# EAGLE design OBC.v1.rev.d (EAGLE 7.1.0)
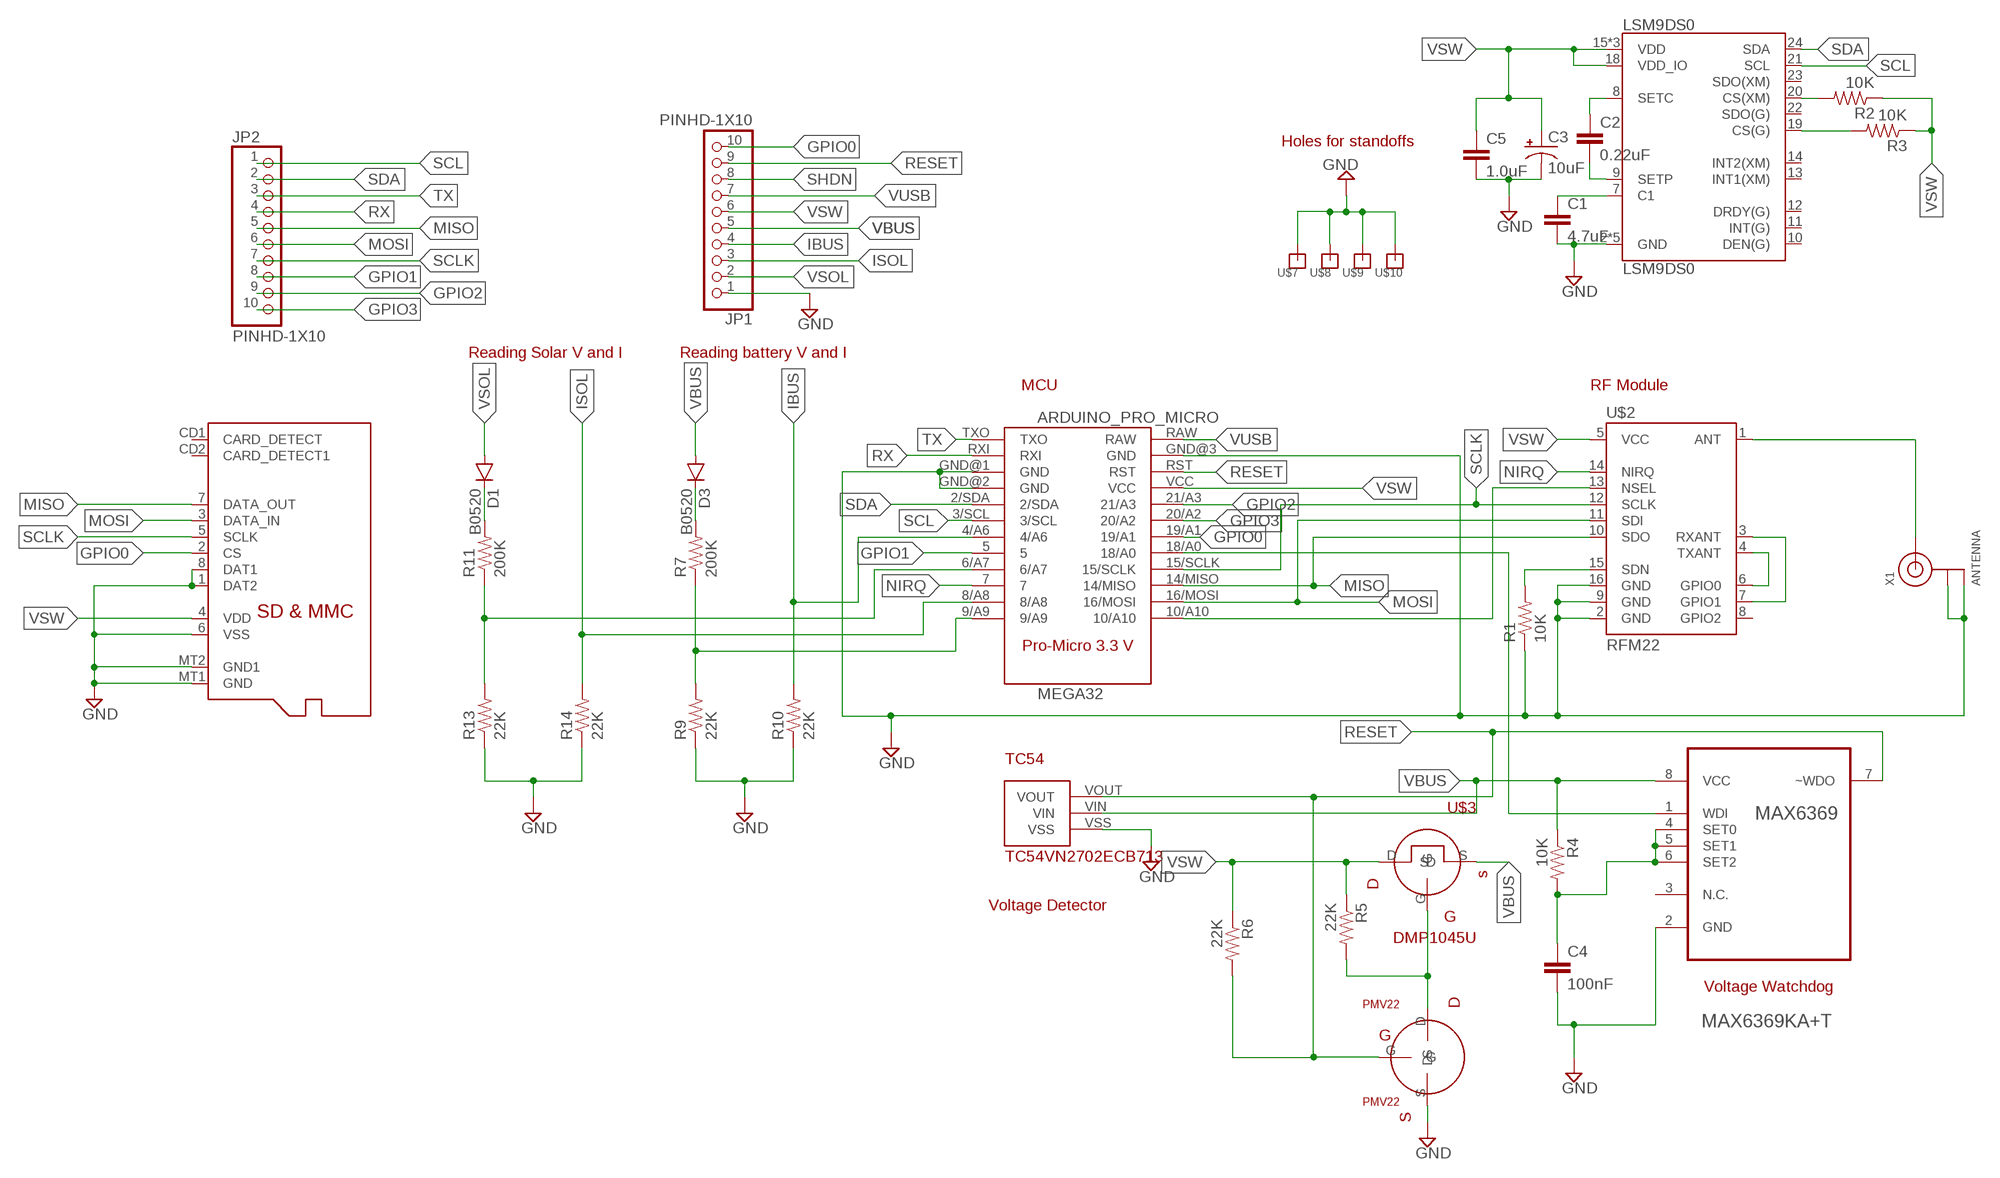
[diagram p0: schematic, sheet 1]

## Parts
ARDUINO_PRO_MICRO  MEGA32  [MEGA32]
C1  4.7uF  CAP0402-CAP  [0402-CAP]
C2  0.22uF  CAP0402-CAP  [0402-CAP]
C3  10uF  CAP_POL1206  [EIA3216]
C4  100nF  CAP0402-CAP  [0402-CAP]
C5  1.0uF  CAP0402-CAP  [0402-CAP]
D1  B0520  DIODESOD123  [SOD-123]
D3  B0520  DIODESOD123  [SOD-123]
JP1  PINHD-1X10  [1X10-BIG]
JP2  PINHD-1X10  [1X10-BIG]
LSM9DS0  LSM9DS0  [LGA-24]
MAX6369  MAX6369KA+T  [SOT65P280X145-8N]
PMV22  PMV22  [PMV22]
R1  10K  RESISTOR0402-RES  [0402-RES]
R2  10K  RESISTOR0402-RES  [0402-RES]
R3  10K  RESISTOR0402-RES  [0402-RES]
R4  10K  RESISTOR0402-RES  [0402-RES]
R5  22K  RESISTOR0402-RES  [0402-RES]
R6  22K  RESISTOR0402-RES  [0402-RES]
R7  200K  RESISTOR0402-RES  [0402-RES]
R9  22K  RESISTOR0402-RES  [0402-RES]
R10  22K  RESISTOR0402-RES  [0402-RES]
R11  200K  RESISTOR0402-RES  [0402-RES]
R13  22K  RESISTOR0402-RES  [0402-RES]
R14  22K  RESISTOR0402-RES  [0402-RES]
TC54  TC54VN2702ECB713  TC54  [TC54]
U$2  RFM22  RFM22SMD  [RFM22-XXX-S2]
U$3  DMP1045U  [DMP1045U]
U$7  3MMPILAR  [3MMPILAR]
U$8  3MMPILAR  [3MMPILAR]
U$9  3MMPILAR  [3MMPILAR]
U$10  3MMPILAR  [3MMPILAR]
X1  ANTENNA  ANTENNA_U.FL  [U.FL]
μSD  MICROSD  [MICROSD]

## Nets
DUMMY: ARDUINO_PRO_MICRO.9/A9 R7.1 R9.2
GND: ARDUINO_PRO_MICRO.GND@1(GND) ARDUINO_PRO_MICRO.GND@2(GND) ARDUINO_PRO_MICRO.GND@3(GND) C1.2 C3.C(-) C4.2 C5.2 JP1.1 LSM9DS0.2(GND) LSM9DS0.3(GND) LSM9DS0.4(GND) LSM9DS0.5(GND) LSM9DS0.6(GND) MAX6369.2(GND) PMV22.S R1.1 R9.1 R10.1 R13.1 R14.1 TC54.VSS U$2.2(GND) U$2.9(GND) U$2.16(GND) U$7.P$1 U$8.P$1 U$9.P$1 U$10.P$1 X1.1(GND) X1.2(GND) μSD.1(DAT2) μSD.6(VSS) μSD.8(DAT1) μSD.MT1(GND) μSD.MT2(GND1)
GPIO0: ARDUINO_PRO_MICRO.19/A1 JP1.10 μSD.2(CS)
GPIO1: ARDUINO_PRO_MICRO.5 JP2.8
GPIO2: ARDUINO_PRO_MICRO.21/A3 JP2.9
GPIO3: ARDUINO_PRO_MICRO.20/A2 JP2.10
IBUS: ARDUINO_PRO_MICRO.4/A6 JP1.4 R10.2
ISOL: ARDUINO_PRO_MICRO.8/A8 JP1.3 R14.2
MISO: ARDUINO_PRO_MICRO.14/MISO JP2.5 U$2.10(SDO) μSD.7(DATA_OUT)
MOSI: ARDUINO_PRO_MICRO.16/MOSI JP2.6 U$2.11(SDI) μSD.3(DATA_IN)
N$1: U$2.1(ANT) X1.3(SIGNAL)
N$2: U$2.3(RXANT) U$2.7(GPIO1)
N$3: R1.2 U$2.15(SDN)
N$4: C1.1 LSM9DS0.7(C1)
N$5: U$2.4(TXANT) U$2.6(GPIO0)
N$6: C2.2 LSM9DS0.9(SETP)
N$7: C2.1 LSM9DS0.8(SETC)
N$9: LSM9DS0.20(CS(XM)) R2.2
N$10: LSM9DS0.19(CS(G)) R3.2
N$12: D3.C R7.2
N$13: C4.1 MAX6369.4(SET0) MAX6369.5(SET1) MAX6369.6(SET2) R4.2
N$14: ARDUINO_PRO_MICRO.6/A7 R11.1 R13.2
N$15: PMV22.D R5.2 U$3.G
N$19: ARDUINO_PRO_MICRO.18/A0 MAX6369.1(WDI)
N$21: D1.C R11.2
NIRQ: ARDUINO_PRO_MICRO.7 U$2.14(NIRQ)
NSEL: ARDUINO_PRO_MICRO.10/A10 U$2.13(NSEL)
RESET: ARDUINO_PRO_MICRO.RST JP1.9 MAX6369.7(~WDO) PMV22.G R6.2 TC54.VOUT
RX: ARDUINO_PRO_MICRO.RXI JP2.4
SCL: ARDUINO_PRO_MICRO.3/SCL JP2.1 LSM9DS0.21(SCL)
SCLK: ARDUINO_PRO_MICRO.15/SCLK JP2.7 U$2.12(SCLK) μSD.5(SCLK)
SDA: ARDUINO_PRO_MICRO.2/SDA JP2.2 LSM9DS0.24(SDA)
SHDN: JP1.8
TX: ARDUINO_PRO_MICRO.TXO JP2.3
VBUS: D3.A JP1.5 MAX6369.8(VCC) R4.1 TC54.VIN U$3.S
VSOL: D1.A JP1.2
VSW: ARDUINO_PRO_MICRO.VCC C3.A(+) C5.1 JP1.6 LSM9DS0.15(VDD) LSM9DS0.16(VDD) LSM9DS0.17(VDD) LSM9DS0.18(VDD_IO) R2.1 R3.1 R5.1 R6.1 U$2.5(VCC) U$3.D μSD.4(VDD)
VUSB: ARDUINO_PRO_MICRO.RAW JP1.7
Unconnected: LSM9DS0.10(DEN(G)) LSM9DS0.11(INT(G)) LSM9DS0.12(DRDY(G)) LSM9DS0.13(INT1(XM)) LSM9DS0.14(INT2(XM)) LSM9DS0.22(SDO(G)) LSM9DS0.23(SDO(XM)) MAX6369.3(N.C.) U$2.8(GPIO2) μSD.CD1(CARD_DETECT) μSD.CD2(CARD_DETECT1)

## Notes on the sheet
- Holes for standoffs
- Reading Solar V and I | Reading battery V and I
- MCU | RF Module
- Voltage Detector
- Voltage Watchdog

## Library data of the parts
ARDUINO_PRO_MICRO = promicro:MEGA32
C1 C2 C4 C5 = SparkFun-Passives:CAP: Capacitor Standard 0603 ceramic capacitor, and 0.1" leaded capacitor.
C3 = SparkFun-Capacitors:CAP_POL: Capacitor Polarized These are standard SMD and PTH capacitors. Normally 10uF, 47uF, and 100uF in electrolytic and tantalum varieties. Always verify the external diameter of the through hole cap, it varies with capacity, voltage, and manufacturer. The EIA devices should be standard.
D1 D3 = SparkFun-DiscreteSemi:DIODE: Diode These are standard reverse protection diodes and small signal diodes. SMA package can handle up to about 1A. SOD-323 can handle about 200mA. What the SOD-323 package when ordering, there are some mfgs out there that are 5-pin packages.
JP1 JP2 = adafruit:PINHD-1X10: Pin header 1x10 0.1" spacing With round pins
LSM9DS0 = SparkFun-DigitalIC:LSM9DS0: LSM9DS0 3D Accelerometer, 3D Gyroscope, 3D Magnetomter Features: 3 acceleration channels, 3 angular rate channels, 3 magnetic field channels ±2/±4/±6/±8/±16 g linear acceleration full scale ±2/±4/±8/±12 gauss magnetic full scale ±245/±500/±2000 dps angular rate full scale 16-bit data output SPI / I2C serial interfaces Analog supply voltage 2.4 V to 3.6 V Power-down mode / low-power mode Programmable interrupt generators Embedded self-test Embedded temperature sensor Embedded FIFO Position and motion detection functions Click/double-click recognition
MAX6369 = Maxim_By_element14_Batch_1:MAX6369KA+T: Pin-Selectable Watchdog Timers; MPN: MAX6369KA+T; OC_FARNELL: 1787051; OC_NEWARK: 68K9450; PACKAGE: SOT23-8; SUPPLIER: Maxim
PMV22 = promicro:PMV22
R1-R7 R9-R11 R13 R14 = SparkFun-Passives:RESISTOR: Resistor Basic schematic elements and footprints for 0603, 1206, and PTH resistors.
TC54 = promicro:TC54
U$2 = SparkFun-RF:RFM22: The RFM22 is a low-power, low cost radio that is capable of operating in the 434MHz and 900MHz open bands. It's frequency is software defined and there are some very good libraries written for it.
U$3 = promicro:DMP1045U; EAGLE: SOT23
U$7-U$10 = LMA:3MMPILAR
X1 = adafruit:ANTENNA_U.FL: U.FL Antenna Connector
μSD = adafruit:MICROSD: Micro-SD / Transflash card holder with SPI pinout For the 3M # 2908-05WB-MG and/or 4UCON #19656 push-push type

## Board
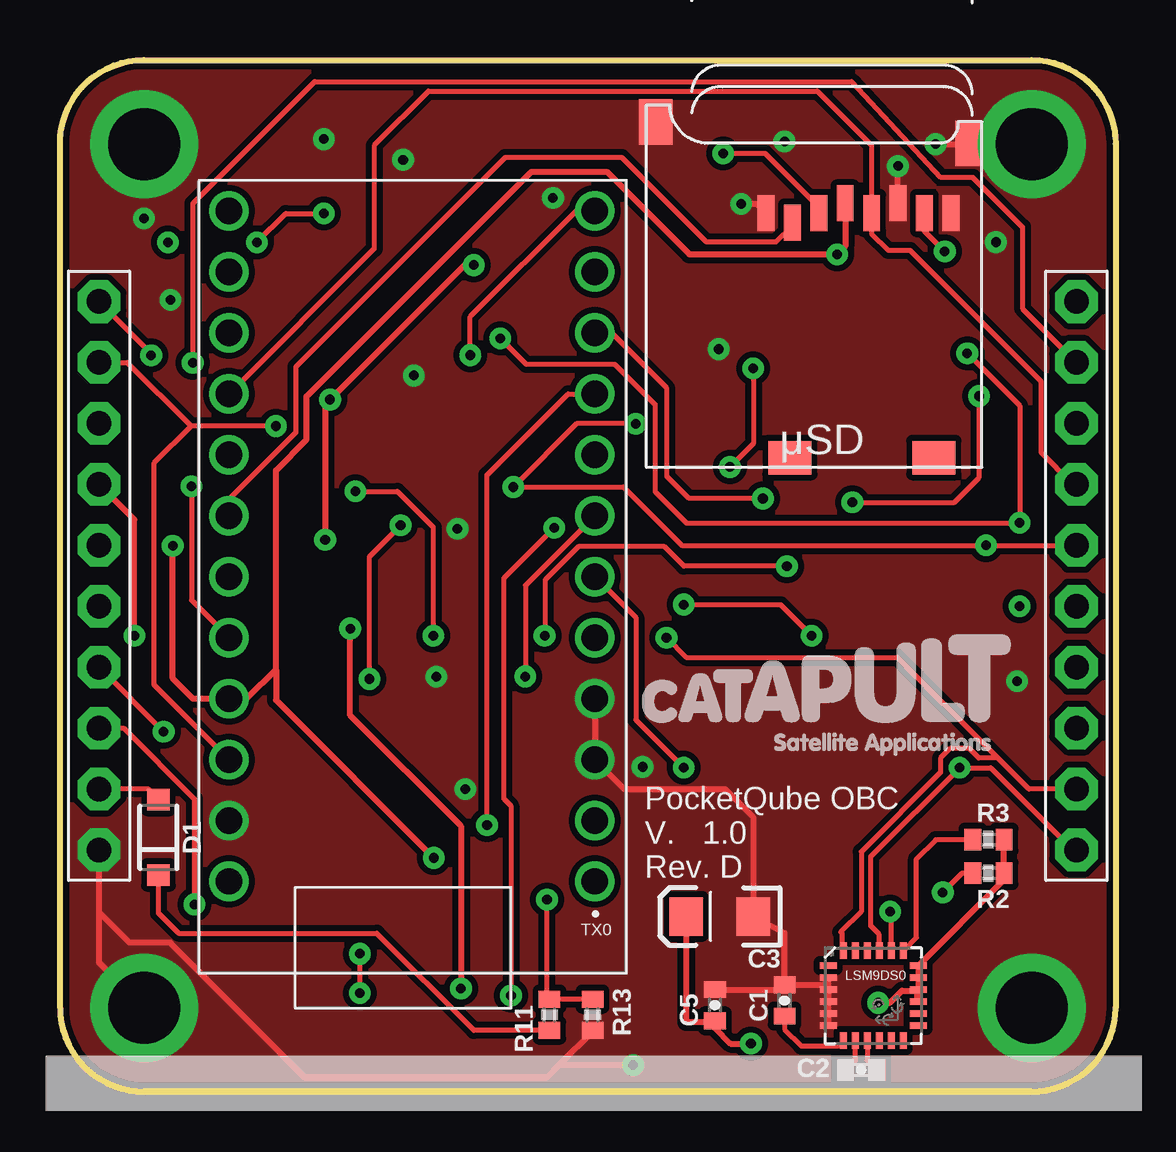
[diagram p1: board, top side]
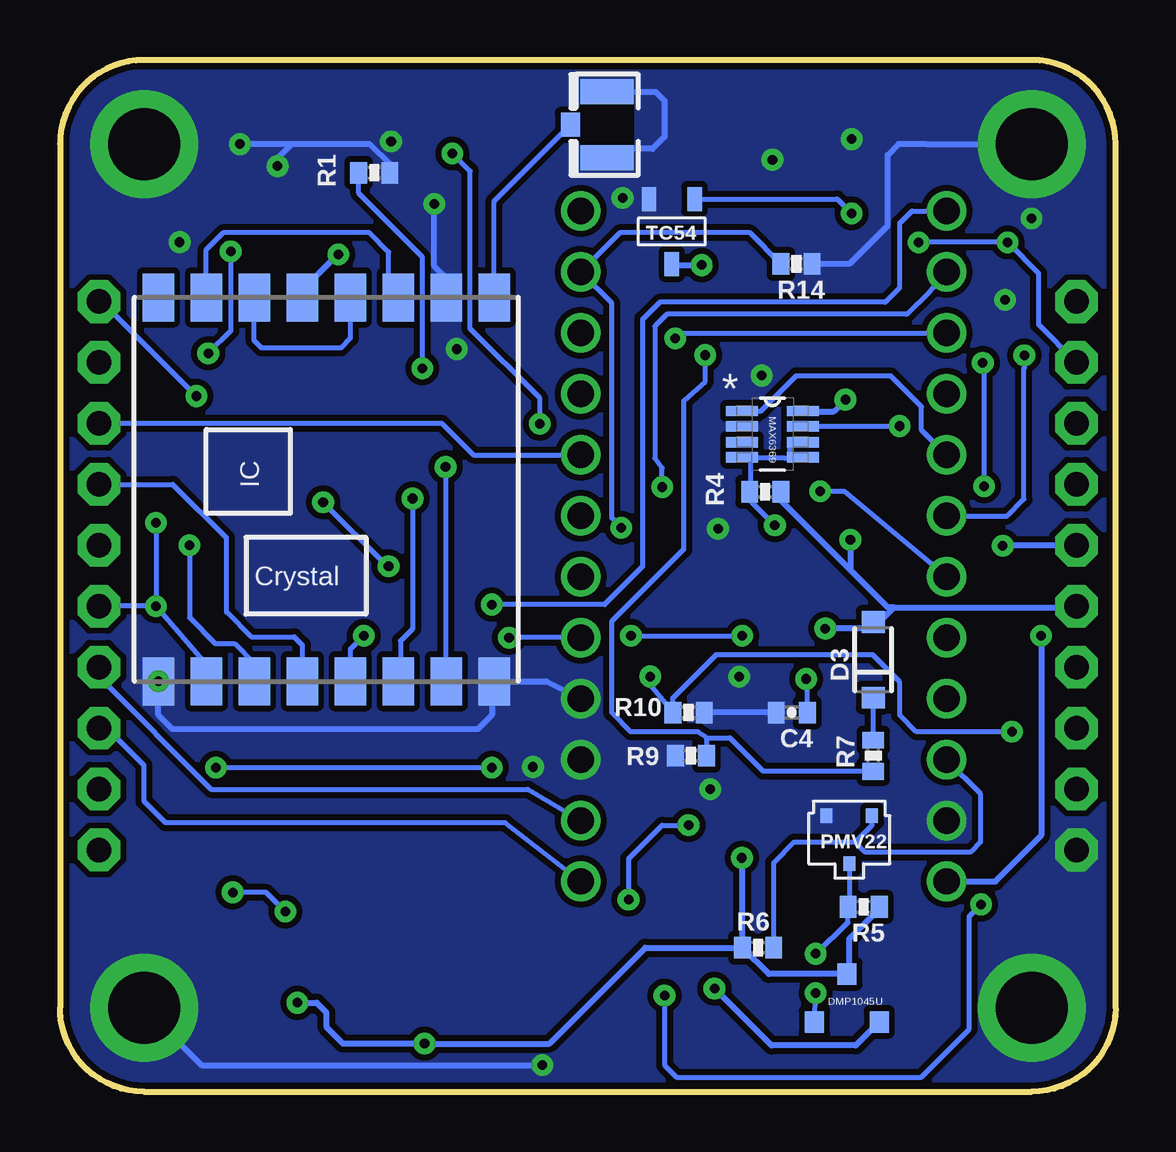
[diagram p2: board, bottom side, seen from below]

Size 44 x 43 mm. Coordinates in mm from the lower left corner, seen from the top.
Outline: 3.5,43 40.5,43 arc-90 44,39.5 44,3.5 arc-90 40.5,0 3.5,0 arc-90 0,3.5 0,39.5 arc-90 3.5,43
Copper layers (1*16): Top 0.035mm / dielectric 1.5mm / Bottom 0.035mm
Design rules "pcbtrain": minimum track width 0.2mm, minimum drill 0.4mm, track to track 0.2mm, track to pad 0.2mm, pad to pad 0.2mm, via to via 0.2mm, smd to smd 0mil, copper to edge 10mil, drill to drill 0.2mm, minimum pad ring 10mil, minimum via ring 10mil, stop-mask expansion 0.125mm, vias tented up to drill 0mil, thermal gap 10mil

### Footprints (pad centres in the part's own frame; a part is rotated, then mirrored left to right if it is on the bottom)
MEGA32 = drill 1.1: 2/SDA 0,5.08; 3/SCL 0,2.54; 4/A6 0,0; 5 0,-2.54; 6/A7 0,-5.08; 7 0,-7.62; 8/A8 0,-10.16; 9/A9 0,-12.7; 10/A10 15.25,-12.7; 14/MISO 15.25,-7.62; 15/SCLK 15.25,-5.08; 16/MOSI 15.25,-10.16; 18/A0 15.25,-2.54; 19/A1 15.25,0; 20/A2 15.25,2.54; 21/A3 15.25,5.08; GND@1 0,10.17; GND@2 0,7.62; GND@3 15.25,12.7; RAW 15.25,15.24; RST 15.25,10.17; RXI 0,12.7; TXO 0,15.24; VCC 15.25,7.62
0402-CAP = smd 0.7 x 0.9: 1 -0.65,0; 2 0.65,0
EIA3216 = smd 1.4 x 1.6: A 1.4,0; C -1.4,0
SOD-123 = smd 0.9 x 0.95: A 1.575,0; C -1.575,0
1X10-BIG = drill 1.016 pad 1.778 octagon: 1 -11.43,0; 2 -8.89,0; 3 -6.35,0; 4 -3.81,0; 5 -1.27,0; 6 1.27,0; 7 3.81,0; 8 6.35,0; 9 8.89,0; 10 11.43,0
LGA-24 = smd 0.7 x 0.29: 1 -1.875,1.25; 2 -1.875,0.75; 3 -1.875,0.25; 4 -1.875,-0.25; 5 -1.875,-0.75; 6 -1.875,-1.25; 13 1.875,-1.25; 14 1.875,-0.75; 15 1.875,-0.25; 16 1.875,0.25; 17 1.875,0.75; 18 1.875,1.25 | smd 0.29 x 0.7: 7 -1.25,-1.875; 8 -0.75,-1.875; 9 -0.25,-1.875; 10 0.25,-1.875; 11 0.75,-1.875; 12 1.25,-1.875; 19 1.25,1.875; 20 0.75,1.875; 21 0.25,1.875; 22 -0.25,1.875; 23 -0.75,1.875; 24 -1.25,1.875
SOT65P280X145-8N = smd 1.321 x 0.432: 1 -1.27,0.965; 2 -1.27,0.33; 3 -1.27,-0.33; 4 -1.27,-0.965; 5 1.27,-0.965; 6 1.27,-0.33; 7 1.27,0.33; 8 1.27,0.965
PMV22 = smd 0.5 x 0.6: D 0,0; G 0.95,2; S -0.95,2
0402-RES = smd 0.7 x 0.9: 1 -0.65,0; 2 0.65,0
TC54 = smd 0.6 x 1: VIN 0,0; VOUT -0.95,-2.7; VSS 0.95,-2.7
RFM22-XXX-S2 = smd 2 x 1.3: 1 -8,7; 2 -8,5; 3 -8,3; 4 -8,1; 5 -8,-1; 6 -8,-3; 7 -8,-5; 8 -8,-7; 9 8,-7; 10 8,-5; 11 8,-3; 12 8,-1; 13 8,1; 14 8,3; 15 8,5; 16 8,7
DMP1045U = smd 0.8 x 0.9: D 0,0; G -1.35,-2; S 1.35,-2
3MMPILAR = drill 3 pad 4.5: P$1 0,0
U.FL = smd 2.2 x 1.05: 1 0,1.375; 2 0,-1.375 | smd 0.8 x 1: 3 1.525,0
MICROSD = smd 0.7 x 1.5: 1 9,-10.64; 2 7.9,-10.24; 3 6.8,-10.64; 4 5.7,-11.04; 5 4.6,-10.64; 6 3.5,-11.04; 7 2.4,-10.64; 8 1.3,-10.64 | smd 1.8 x 1.4: CD1 2,-0.44; CD2 8,-0.44 | smd 1.4 x 1.9: MT1 0.4,-13.54; MT2 13.6,-14.44

### Placement (x,y rotation side)
ARDUINO_PRO_MICRO  22.3,24 180 top
C1  30.2,3.8 90 top
C2  33.4,0.9 0 top
C3  27.5,7.3 180 top
C4  13.5,15.8 180 bottom
C5  27.3,3.6 90 top
D1  4.1,10.6 90 top
D3  10.1,18 90 bottom
JP1  1.63,21.5 90 top
JP2  42.37,21.5 90 top
LSM9DS0  33.9,4 0 top
MAX6369  14.3,27.4 0 bottom
PMV22  11.1,9.5 0 bottom
R1  30.9,38.3 180 bottom
R2  38.7,9.1 180 top
R3  38.7,10.5 180 top
R4  14.6,25 180 bottom
R5  10.5,7.7 180 bottom
R6  14.9,6 0 bottom
R7  10.1,14 90 bottom
R9  17.7,14 0 bottom
R10  17.8,15.8 180 bottom
R11  20.4,3.2 270 top
R13  22.2,3.2 90 top
R14  13.3,34.5 180 bottom
TC54  18.5,34.5 180 bottom
U$2  32.9,25.1 270 bottom
U$3  11.2,4.9 0 bottom
U$7  3.5,39.5 0 top
U$8  40.5,39.5 0 top
U$9  40.5,3.5 0 top
U$10  3.5,3.5 0 top
X1  21.2,40.3 180 bottom
μSD  38.43,25.98 180 top

### Tracks (layer width: path | path; a pad name or v marks a point on that pad's centre or on a via)
DUMMY  (via drill 0.4)
  Top 0.2: v17.1,30.7 17.1,32.3 21.5,36.7 ARDUINO_PRO_MICRO.9/A9
  Bottom 0.2: 16.9,14.15 R9.2 | R9.2 17.15,14.2 | v17.1,30.7 17.1,29.6 18,28.8 18,22.58 18.03,22.58 21,19.61 21,15.8 20.2,15 17.4,15 17.1,14.8 17.05,14.75 | 17.1,14.35 R9.2 | 17.05,14.75 R9.2 | R7.1 14.68,13.35 16.08,14.75 17.05,14.75
GND  (via drill 0.4)
  Top 0.254: C3.C 29.4,7.1 29.1,6.8 | C5.2 30,4.25 C1.2 | C1.2 30.2,6.6 C3.C | C1.2 31.93,4.45 LSM9DS0.2 LSM9DS0.3 LSM9DS0.4 LSM9DS0.5 LSM9DS0.6 | 20.85,1.15 20.3,0.6 10.2,0.6 4.6,6.2 2.9,6.2 1.63,7.47 | 20.85,1.15 22.2,2.5 R13.1 | v23.9,1.1 20.9,1.1 20.85,1.15 | U$10.P$1 1.63,5.37 1.63,7.47 | 1.63,7.47 JP1.1 | ARDUINO_PRO_MICRO.GND@2 ARDUINO_PRO_MICRO.GND@1 23.52,12.61 27.72,12.61 28.9,11.43 C3.C | v36.5,39.49 38,39.49 μSD.MT1 40.48,39.52 U$8.P$1 | μSD.6 v34.93,38.58 | 37.11,36.6 μSD.8 | μSD.1 29.05,37 v28.4,37
  Bottom 0.254: ARDUINO_PRO_MICRO.GND@2 23.72,17.1 U$2.16 26,17 26,15.7 26.6,15.1 39.3,15.1 39.9,15.7 U$2.9 | C4.2 R10.1 | U$2.2 27.9,33.9 28.4,34.4 v28.4,37 | X1.2 19.18,41.67 18.8,41.3 18.8,39.8 19.3,39.3 21.18,39.3 X1.1 | U$9.P$1 38.1,1.1 v23.9,1.1 | R1.1 30.25,38.65 31.1,39.5 32.13,39.5 34.34,39.5 | R14.1 11.1,34.5 9.5,36.1 9.5,39.04 9.04,39.5 7.9,39.5 U$7.P$1 | 34.34,39.5 v36.5,39.49 | v34.93,38.58 34.93,38.9 34.34,39.5
  other vias: 30.2,39.6 27.46,30.95 16.9,12.6 16.57,23.45 4.6,33 3.5,36.4 11,39.7 14.3,38.84 39.9,17.1 24.29,13.53 14.75,29.85 20.55,37.25 15.69,17.29 39.02,35.41
  pour Bottom (isolate 0.25, no thermals): 0,43 44,43 44,0 0,0
  pour Top (isolate 0.25, no thermals): 0,0 44,0 44,43 0,43
GPIO0  (via drill 0.4)
  Top 0.2: JP1.10 3.8,30.76 v3.8,30.69 | ARDUINO_PRO_MICRO.19/A1 7.05,24.69 9.83,27.47 9.83,30.2 18.56,38.93 23.42,38.93 26.93,35.42 29.85,35.42 30.53,36.1 μSD.2
  Bottom 0.2: v3.8,30.69 3.8,30.18 3.82,30.16 3.82,24.7 4.51,24 ARDUINO_PRO_MICRO.19/A1
GPIO1
  Bottom 0.2: ARDUINO_PRO_MICRO.5 26.77,26.54 28.08,27.85 JP2.8
GPIO2  (via drill 0.4)
  Top 0.2: v5.54,30.38 5.54,37.02 10.62,42.1 33,42.1 36.72,38.1 38.06,38.1 40.12,36.04 40.12,32.64 JP2.9 | v5.48,25.23 5.48,20.49 ARDUINO_PRO_MICRO.21/A3
  Bottom 0.2: v5.54,30.38 5.48,30.32 v5.48,25.23
GPIO3  (via drill 0.4)
  Top 0.2: v20.2,19 20.23,18.81 20.23,21.34 21.61,22.72 25.19,22.72 26.01,21.9 v30.3,21.9 | v38.31,28.99 38.31,25.6 37.28,24.56 v33.03,24.56 | v12.31,25.02 14.07,25.02 15.56,23.53 v15.56,19
  Bottom 0.2: 20.07,18.72 v20.2,19 v15.56,19 | ARDUINO_PRO_MICRO.20/A2 11.31,25.02 v12.31,25.02 | v30.3,21.9 30.37,21.9 v33.03,24.56 | JP2.10 42.25,32.93 v38.31,28.99
IBUS  (via drill 0.4)
  Top 0.2: v19.4,17.3 19.4,21.1 ARDUINO_PRO_MICRO.4/A6 | JP1.4 v4.32,15
  Bottom 0.2: v4.32,15 8.3,15 8.99,15.69 8.99,17.06 10.12,18.2 16.66,18.2 18.45,16.41 R10.2 19.4,16.95 v19.4,17.3
ISOL  (via drill 0.4)
  Top 0.2: JP1.3 2.65,15.15 5.6,12.2 v5.6,7.8 | v18.8,4 18.8,11.9 18.5,12.2 18.5,21.4 v20.6,23.5
  Bottom 0.2: v20.6,23.5 21,23.9 21,32.86 ARDUINO_PRO_MICRO.8/A8 20.66,35.8 15.25,35.8 R14.2 | v18.8,4 18.8,1.1 18.3,0.6 8.1,0.6 6.1,2.6 6.1,7.3 v5.6,7.8
MISO  (via drill 0.4)
  Top 0.2: v18.35,31.4 19.43,30.32 23.12,30.32 24.82,28.62 24.82,24.99 26.12,23.7 31.47,23.7 v40,23.71 40,28.59 v37.82,30.77 | μSD.7 36.03,35.87 v36.88,35.02
  Bottom 0.2: U$2.10 37.9,17.83 v40,20.23 | v40,20.23 JP2.5 | v18.35,31.4 18.13,31.62 ARDUINO_PRO_MICRO.14/MISO | v40,23.71 v40,20.23 | v36.88,35.02 36.88,31.71 v37.82,30.77
MOSI  (via drill 0.4)
  Top 0.2: JP2.6 v38.6,22.77 25.92,22.77 23.49,25.2 v18.9,25.2 21.54,27.84 v24,27.84 | μSD.3 31.63,36.87 29.39,39.11 v27.64,39.11
  Bottom 0.2: ARDUINO_PRO_MICRO.16/MOSI 7.75,33.35 8.7,32.4 18.7,32.4 19.2,31.9 19.2,26.4 18.9,26 v18.9,25.2 | U$2.11 35.9,17.85 36.73,18.68 37.52,18.68 38.6,19.75 v38.6,22.77 | v24,27.84 24,28.9 26.9,31.8 26.9,38.37 v27.64,39.11
N$1
  Bottom 0.2: U$2.1 25.9,37.12 X1.3
N$2
  Bottom 0.2: U$2.3 30.3,33.5 30.3,35 31.1,35.8 37.2,35.8 37.9,35.1 U$2.7
N$3  (via drill 0.4)
  Top 0.2: v28.9,30.15 28.9,27.01 v27.93,26.04
  Bottom 0.2: R1.2 31.55,37.45 28.9,34.8 v28.9,30.15 | v27.93,26.04 27.93,17.13 U$2.15
N$4
  Top 0.2: C1.1 30.2,2.6 30.9,1.9 32.62,1.9 LSM9DS0.7
N$5
  Bottom 0.2: U$2.4 31.9,31.4 32.3,31 35.6,31 35.9,31.3 U$2.6
N$6
  Top 0.2: LSM9DS0.9 33.65,1.3 C2.2
N$7
  Top 0.2: C2.1 33.15,1.3 LSM9DS0.8
N$9  (via drill 0.4)
  Top 0.2: R2.2 37.6,9.1 v36.8,8.3 | LSM9DS0.20 34.65,7.45 v34.6,7.5
  Bottom 0.2: v34.6,7.5 35.4,8.3 v36.8,8.3
N$10
  Top 0.2: R3.2 36.5,10.5 35.7,9.7 35.7,6.42 LSM9DS0.19
N$12
  Bottom 0.2: R7.2 D3.C
N$13  (via drill 0.4)
  Top 0.2: v12.9,17.2 12.9,22.3 v14.2,23.6
  Bottom 0.2: MAX6369.6 13.6,27 13.6,26.6 MAX6369.5 13.8,26.4 15.2,26.4 | 15.2,26.4 16,26.4 MAX6369.4 | 15.2,24.6 v14.2,23.6 | 15.2,24.6 15.2,26.4 | 15.2,24.6 R4.2 | C4.1 12.85,17.15 v12.9,17.2
N$14  (via drill 0.4)
  Top 0.2: 22.2,4.1 R13.2 R11.1 20.3,3.95 | 20.2,4.05 20.3,3.95 | ARDUINO_PRO_MICRO.6/A7 21.18,29.08 17.8,25.7 v17.8,11.1 | 20.3,3.95 v20.3,8
  Bottom 0.2: v17.8,11.1 18.9,11.1 20.3,9.7 v20.3,8
N$15  (via drill 0.4)
  Top 0.2: v12.5,4.1 v12.5,5.74
  Bottom 0.2: PMV22.D 11.1,7.75 R5.2 11.15,7.05 v12.5,5.74 | U$3.G v12.5,4.1
N$19
  Bottom 0.2: MAX6369.1 14.78,28.36 13.31,29.84 9.38,29.84 8.09,28.55 8.09,27.58 ARDUINO_PRO_MICRO.18/A0
N$21
  Top 0.2: D1.C 4.1,7.45 4.95,6.6 13.2,6.6 17.25,2.55 R11.2
NIRQ  (via drill 0.4)
  Top 0.2: v29.3,24.72 26.22,24.72 25.3,25.64 25.3,29.32 23,31.62 ARDUINO_PRO_MICRO.7
  Bottom 0.2: v29.3,24.72 29.3,19.29 29.81,18.78 29.81,17.19 U$2.14
NSEL  (via drill 0.4)
  Top 0.2: v26,20.3 30.03,20.3 v31.33,19
  Bottom 0.2: v26,20.3 21.3,20.3 19.7,21.9 19.7,32.2 19,32.9 9.6,32.9 8.99,33.51 8.99,36.2 8.49,36.7 ARDUINO_PRO_MICRO.10/A10 | U$2.13 31.9,18.43 v31.33,19
RESET  (via drill 0.4)
  Top 0.2: v9,27.74 5.46,27.74 | 5.46,27.74 2.81,30.39 JP1.9 | v8.21,35.4 9.41,36.6 v11,36.6 | 5.46,27.74 3.92,26.19 3.92,16.96 ARDUINO_PRO_MICRO.RST
  Bottom 0.2: R6.2 14.25,9.55 13.4,10.4 10.85,10.4 | TC54.VOUT 11.6,37.2 v11,36.6 | 10.85,10.4 10.45,10 6.02,10 5.62,10.4 5.62,12.4 ARDUINO_PRO_MICRO.RST | 10.85,10.4 10.15,11.1 PMV22.G | MAX6369.7 9.24,27.73 v9,27.74 | JP1.9 3.2,31.96 3.2,34.1 v4.5,35.4 v8.21,35.4
RX
  Bottom 0.2: ARDUINO_PRO_MICRO.RXI 24.5,12.6 37.7,12.6 42.37,17.27 JP2.4
SCL  (via drill 0.4)
  Top 0.2: LSM9DS0.21 34.15,6.55 33.8,6.9 33.8,9.8 v37.5,13.5 38.8,13.5 41.8,10.5 41.94,10.5 JP2.1 | ARDUINO_PRO_MICRO.3/SCL 24,19.75 24,15.5 v26,13.5
  Bottom 0.2: v26,13.5 v37.5,13.5
SCLK
  Top 0.2: JP2.7 42.37,25.33 42.21,25.33 40.9,26.64 40.9,29.6 35.44,35.05 34.52,35.05 33.83,35.75 μSD.5 33.83,39.44 31.57,41.7 15.36,41.7 13.1,39.45 13.1,35.13 ARDUINO_PRO_MICRO.15/SCLK
  Bottom 0.2: JP2.7 39.29,25.31 37.06,23.08 37.06,19.99 36.03,18.95 34.24,18.95 33.9,18.62 U$2.12
SDA  (via drill 0.4)
  Top 0.2: 32.65,5.95 LSM9DS0.24 32.6,5.92 32.6,6.6 32.55,6.65 33.4,7.5 33.4,10 36.7,13.3 36.7,13.9 37.1,14.3 37.9,14.3 38.3,13.9 39.1,13.9 | JP2.2 40.39,12.61 39.1,13.9 | v25.28,18.92 26.1,18.1 34.9,18.1 39.1,13.9
  Bottom 0.2: ARDUINO_PRO_MICRO.2/SDA v25.28,18.92
TX
  Bottom 0.2: ARDUINO_PRO_MICRO.TXO 25.44,11.2 39.6,11.2 40.5,12.1 40.5,13.6 42.05,15.15 JP2.3
VBUS  (via drill 0.4)
  Top 0.254: v11.05,23 11.05,28.64 v11.26,28.84 16.87,34.45 v17.25,34.45 | v12.1,19.3 12.1,15.69 16.71,11.07 v16.71,4.29
  Bottom 0.254: 18.41,34.61 TC54.VIN 18.45,34.45 v17.25,34.45 | 13.89,25.06 R4.1 13.95,24.63 11.05,21.73 | MAX6369.8 12.71,28.35 11.75,28.35 v11.26,28.84 | 9.24,20.18 9.5,20.18 11.05,21.73 | 9.24,20.18 10.12,19.3 10.38,19.3 | 10.38,19.3 v12.1,19.3 | U$3.S 10.83,1.92 14.34,1.92 v16.71,4.29 | v11.05,23 11.05,21.73 | D3.A 10.38,19.3 | 9.24,20.18 1.68,20.18 JP1.5
VSOL
  Top 0.2: D1.A 4.1,12.2 3.69,12.61 JP1.2
VSW  (via drill 0.4)
  Top 0.254: R3.1 R2.1 39.35,8.82 LSM9DS0.18 LSM9DS0.17 LSM9DS0.16 35.73,4.2 | v28.8,2 27.95,2 27.3,2.65 C5.1 27.25,2.9 26.1,2.9 C3.A 26,7.4 | v34.1,3.7 34.6,3.7 35.1,4.2 35.73,4.2 | 35.73,4.2 35.73,3.8 LSM9DS0.15 | 9,17.6 7.8,16.4 ARDUINO_PRO_MICRO.VCC 5.54,16.38 4.7,17.21 v4.7,22.75 | 9,17.6 9,25.89 10.28,27.17 10.28,28.97 19.65,38.34 22.8,38.34 26.24,34.9 v32.4,34.9 32.73,35.23 μSD.4 | 9,17.6 9,16.32 v15.58,9.74
  Bottom 0.254: 7.73,16.4 ARDUINO_PRO_MICRO.VCC 7.39,16.38 | v34.1,3.7 33.3,3.7 32.9,3.3 32.9,2.7 32.2,2 v28.8,2 23.6,2 19.6,6 R6.1 | R5.1 9.84,7.62 11.11,6.35 11.11,4.92 U$3.D 14.45,4.9 R6.1 | v15.58,9.74 15.58,6.03 R6.1 | JP1.6 4.6,22.77 v4.7,22.75 | v32.4,34.9 33.9,33.4 U$2.5
VUSB  (via drill 0.4)
  Top 0.254: v3.1,19 3.1,23.84 JP1.7
  Bottom 0.254: ARDUINO_PRO_MICRO.RAW 5.01,8.76 4.01,9.76 3.46,10.3 3.1,10.67 v3.1,19

### Text on the board
tPlace: PocketQube OBC / V. 1.0 / Rev. D | TX0
bNames: TC54 | PMV22 | DMP1045U